# EasyEDA Pro project stm32f401rct6v1.eprj, schematic STM32F401RCT6V1B

## Sheets
1 P1: Create Date: 2024-03-28; Page Name: P1; Project Name: stm32f401rct6v1; Schematic Name: STM32F401RCT6V1B; Update Date: 2024-03-28; Company: 嘉立创EDA; Page Size: A4; Version: V1.0
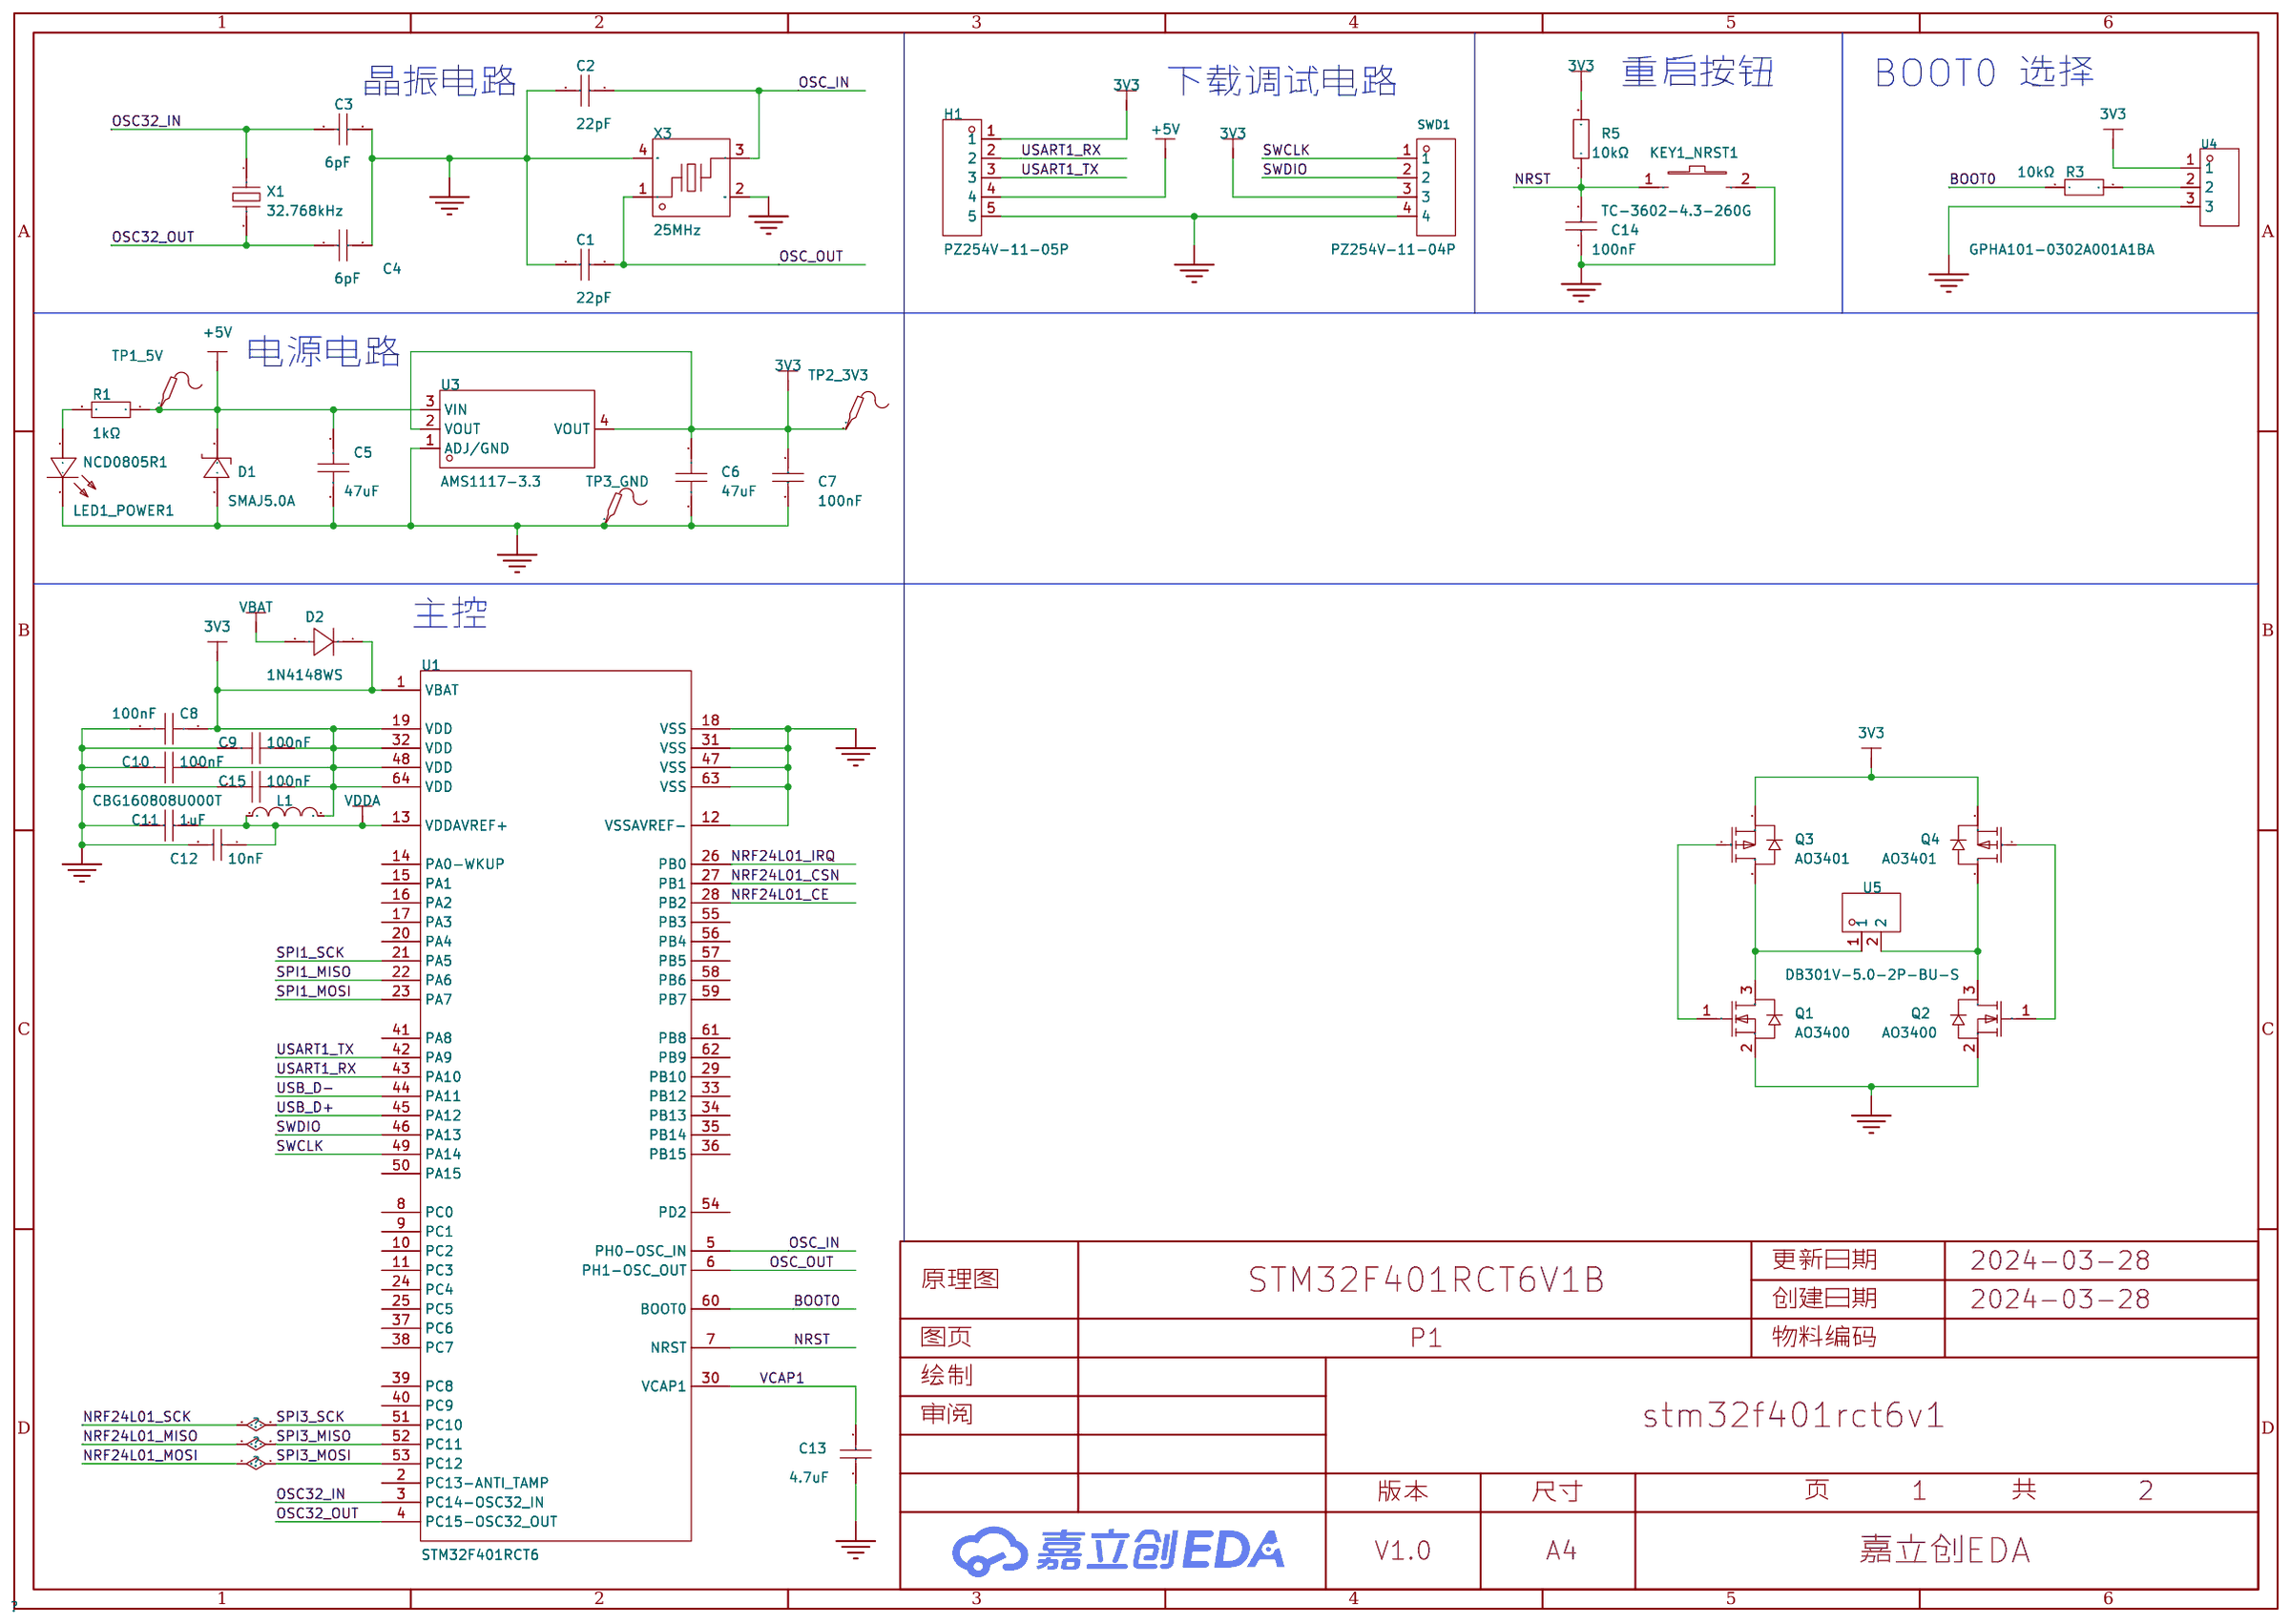
[diagram p1: P1]
2 P2: Page Name: P2
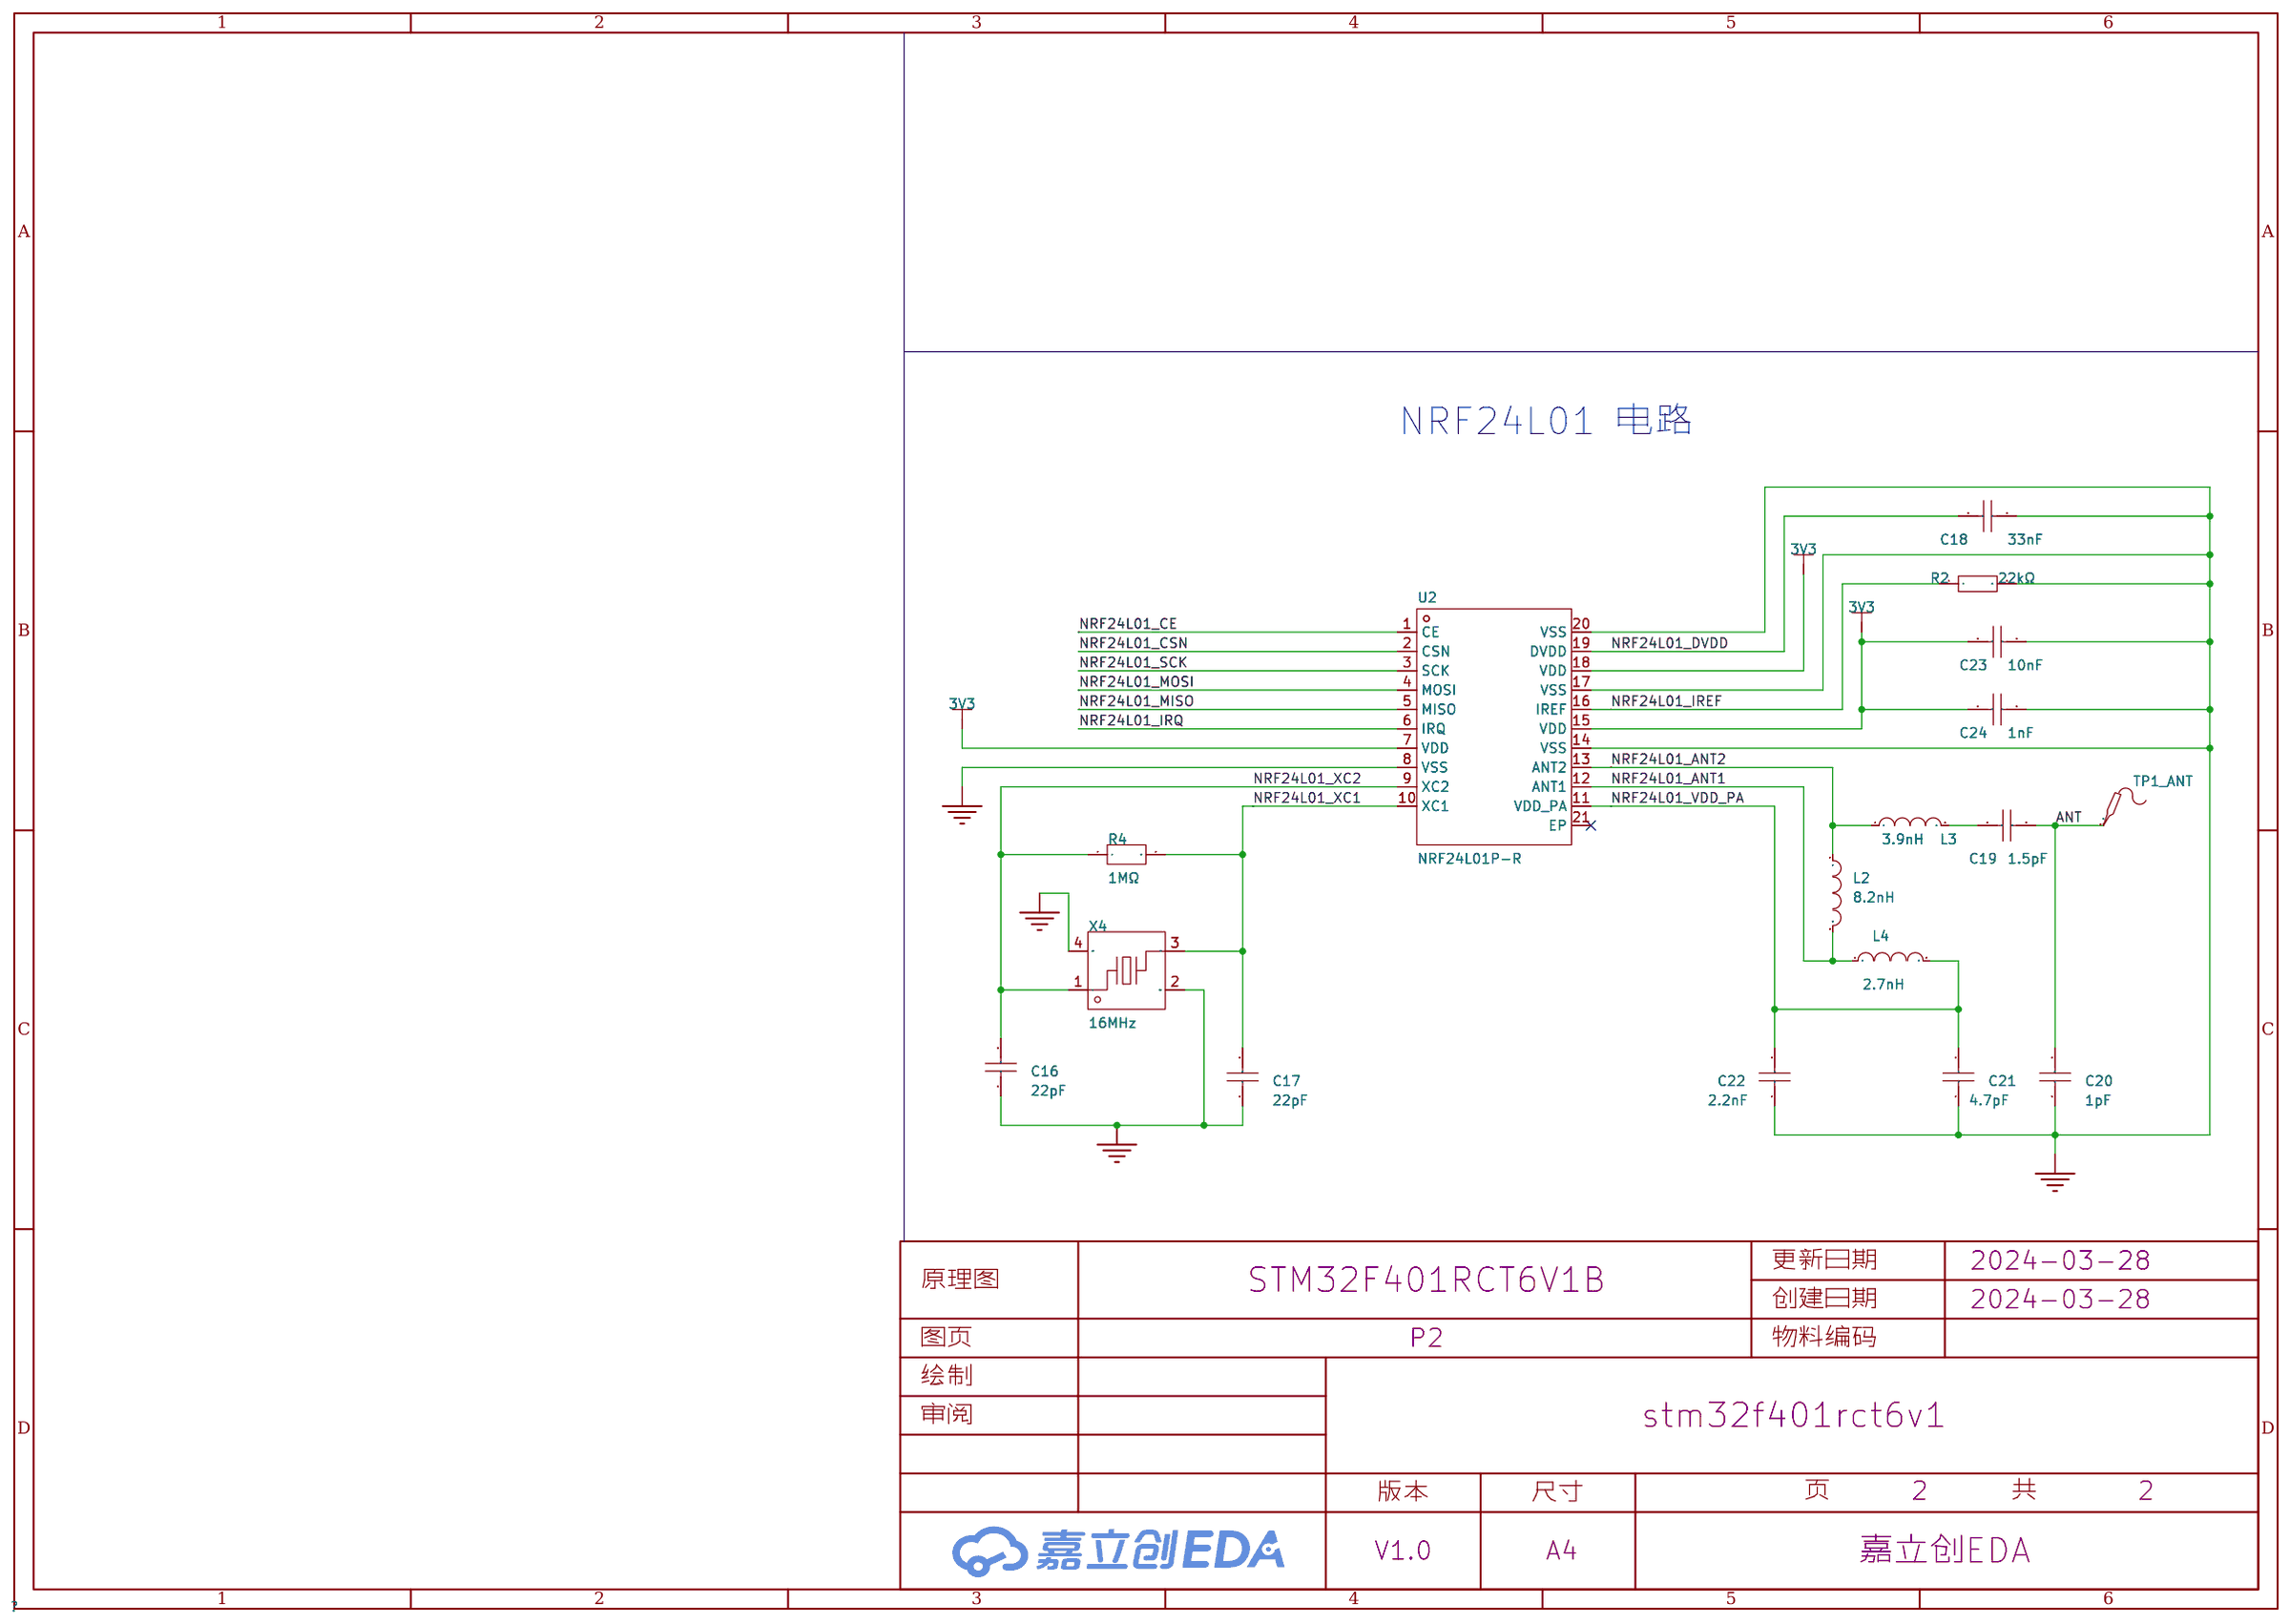
[diagram p2: P2]

## Parts
sheet P1
C1  22pF  [C0603]
C2  22pF  [C0603]
C3  6pF  [C0603]
C4  6pF  [C0603]
C5  47uF  [C1206]
C6  47uF  [C1206]
C7  100nF  [C1206]
C8  100nF  [C0603]
C9  100nF  [C0603]
C10  100nF  [C0603]
C11  1uF  [C0603]
C12  10nF  [C0603]
C13  4.7uF  [C0603]
C14  100nF  [C0603]
C15  100nF  [C0603]
D1  SMAJ5.0A  [SMA_L4.3-W2.6-LS5.2-RD]
D2  1N4148WS  [SOD-323_L1.8-W1.3-LS2.5-RD]
H1  PZ254V-11-05P  [HDR-TH_5P-P2.54-V-M]
KEY1_NRST1  TC-3602-4.3-260G  [KEY-SMD_L6.0-W3.6-LS8.3-L]
L1  CBG160808U000T  [L0603]
LED1_POWER1  NCD0805R1  [LED0805-R-RD]
Q1  AO3400  [SOT-23_L2.9-W1.3-P1.90-LS2.4-BR]
Q2  AO3400  [SOT-23_L2.9-W1.3-P1.90-LS2.4-BR]
Q3  AO3401  [SOT-23-3_L2.9-W1.4-P1.90-LS2.6-BR]
Q4  AO3401  [SOT-23-3_L2.9-W1.4-P1.90-LS2.6-BR]
R1  1kΩ  [R0603]
R3  10kΩ  [R0603]
R5  10kΩ  [R0603]
SWD1  PZ254V-11-04P  [HDR-TH_4P-P2.54-V-M]
TP1_5V  -  [Test-Point-0.5mm]
TP2_3V3  -  [Test-Point-0.5mm]
TP3_GND  -  [Test-Point-0.5mm]
U1  STM32F401RCT6  [LQFP-64_L10.0-W10.0-P0.50-LS12.0-BL]
U3  AMS1117-3.3  [SOT-223_L6.5-W3.5-P2.30-LS7.0-BR]
U4  GPHA101-0302A001A1BA  [HDR-TH_3P-P2.54-V-M]
U5  DB301V-5.0-2P-BU-S  [CONN-TH_2P-P5.00_L7.6-W10.0]
X1  32.768kHz  [OSC-SMD_L3.2-W1.5]
X3  25MHz  [CRYSTAL-SMD_4P-L3.2-W2.5-BL]
sheet P2
C16  22pF  [C0603]
C17  22pF  [C0603]
C18  33nF  [C0603]
C19  1.5pF  [C0603]
C20  1pF  [C0603]
C21  4.7pF  [C0603]
C22  2.2nF  [C0603]
C23  10nF  [C0603]
C24  1nF  [C0603]
L2  8.2nH  [L0603]
L3  3.9nH  [IND-SMD_L1.6-W0.8-1]
L4  2.7nH  [L0603]
R2  22kΩ  [R0603]
R4  1MΩ  [R0603]
TP1_ANT  -  [Test-Point-0.5mm]
U2  NRF24L01P-R  [QFN-20_L4.0-W4.0-P0.50-BL-EP]
X4  16MHz  [CRYSTAL-SMD_4P-L2.0-W1.6-BL]

## Library data of the parts
C1 C2 C16 C17 = CC0603JRNPO9BN220: 容值:22pF;精度:±5%;额定电压:50V;材质(温度系数):NP0;; LCSC Part Name: 22pF ±5% 50V; Supplier Part: C105620; Manufacturer: YAGEO(国巨); Supplier Footprint: 0603; JLCPCB Part Class: 扩展库; Datasheet: https://atta.szlcsc.com/upload/public/pdf/source/20170505/1493957838062.pdf; Supplier: LCSC; Tolerance: ±5%; Voltage Rated: 50V; Temperature Coefficient: NP0
C3 C4 = 0603CG6R0C500NT: 容值:6pF;额定电压:50V;材质(温度系数):C0G;; LCSC Part Name: 6pF 50V ±0.25pF; Supplier Part: C37474; Manufacturer: FH(风华); Supplier Footprint: 0603; JLCPCB Part Class: 扩展库; Datasheet: https://atta.szlcsc.com/upload/public/pdf/source/20200305/C486355_26A10D38EF8C2A5C37091D0039909270.pdf; Supplier: LCSC; Voltage Rated: 50V; Temperature Coefficient: C0G
C5 C6 = GRM31CR61E476ME44L: 容值:47uF;精度:±20%;额定电压:25V;材质(温度系数):X5R;; LCSC Part Name: 47uF ±20% 25V; Supplier Part: C403725; Manufacturer: muRata(村田); Supplier Footprint: 1206; JLCPCB Part Class: 扩展库; Datasheet: https://atta.szlcsc.com/upload/public/pdf/source/20191025/C403725_B8A8CD2FFA1F57E6FDF268BD106459D5.pdf; Supplier: LCSC; Tolerance: ±20%; Voltage Rated: 25V; Temperature Coefficient: X5R
C7 = CL31B104KBCNNNC: 容值:100nF;精度:±10%;额定电压:50V;材质(温度系数):X7R;; LCSC Part Name: 100nF ±10% 50V; Supplier Part: C24497; Manufacturer: SAMSUNG(三星); Supplier Footprint: 1206; JLCPCB Part Class: 基础库; Datasheet: https://atta.szlcsc.com/upload/public/pdf/source/20160218/1457707763339.pdf; Supplier: LCSC; Tolerance: ±10%; Voltage Rated: 50V; Temperature Coefficient: X7R
C8-C10 C15 = CC0603KRX7R9BB104: 容值:100nF;精度:±10%;额定电压:50V;材质(温度系数):X7R;; LCSC Part Name: 100nF ±10% 50V; Supplier Part: C14663; Manufacturer: YAGEO(国巨); Supplier Footprint: 0603; JLCPCB Part Class: 基础库; Datasheet: https://atta.szlcsc.com/upload/public/pdf/source/20180910/C282072_33301C7F631E79921B82A8DAC6BCC5B3.pdf; Supplier: LCSC; Tolerance: ±10%; Voltage Rated: 50V; Temperature Coefficient: X7R
C11 = CL10A105KB8NNNC: 容值:1uF;精度:±10%;额定电压:50V;材质(温度系数):X5R;; LCSC Part Name: 1uF ±10% 50V; Supplier Part: C15849; Manufacturer: SAMSUNG(三星); Supplier Footprint: 0603; JLCPCB Part Class: 基础库; Datasheet: https://atta.szlcsc.com/upload/public/pdf/source/20160218/1457707763339.pdf; Supplier: LCSC; Tolerance: ±10%; Voltage Rated: 50V; Temperature Coefficient: X5R
C12 C23 = CC0603KRX7R9BB103: 容值:10nF;精度:±10%;额定电压:50V;材质(温度系数):X7R;; LCSC Part Name: 10nF ±10% 50V; Supplier Part: C100042; Manufacturer: YAGEO(国巨); Supplier Footprint: 0603; JLCPCB Part Class: 扩展库; Datasheet: https://atta.szlcsc.com/upload/public/pdf/source/20181008/C309510_22F155564471FAF6A489F7D68F34234E.pdf; Supplier: LCSC; Tolerance: ±10%; Voltage Rated: 50V; Temperature Coefficient: X7R
C13 = CL10A475KO8NNNC: 容值:4.7uF;精度:±10%;额定电压:16V;材质(温度系数):X5R;; LCSC Part Name: 4.7uF ±10% 16V; Supplier Part: C19666; Manufacturer: SAMSUNG(三星); Supplier Footprint: 0603; JLCPCB Part Class: 基础库; Datasheet: https://atta.szlcsc.com/upload/public/pdf/source/20160218/1457707763339.pdf; Supplier: LCSC; Tolerance: ±10%; Voltage Rated: 16V; Temperature Coefficient: X5R
C14 = 0603B104K500NT: 容值:100nF;精度:±10%;额定电压:50V;材质(温度系数):X7R;; LCSC Part Name: 100nF ±10% 50V; Supplier Part: C30926; Manufacturer: FH(风华); Supplier Footprint: 0603; JLCPCB Part Class: 扩展库; Datasheet: https://atta.szlcsc.com/upload/public/pdf/source/20200305/C486355_26A10D38EF8C2A5C37091D0039909270.pdf; Supplier: LCSC; Tolerance: ±10%; Voltage Rated: 50V; Temperature Coefficient: X7R
D1 = SMAJ5.0A_C10758: 反向截止电压(Vrwm):5V;最大钳位电压:9.2V;峰值脉冲电流(Ipp)@10/1000us:43.5A;击穿电压:6.4V;; LCSC Part Name: 单向TVS 5V截止 43.5A峰值脉冲; Supplier Part: C10758; Manufacturer: RUILON(瑞隆源); Supplier Footprint: SMA(DO-214AC); JLCPCB Part Class: 扩展库; Datasheet: https://atta.szlcsc.com/upload/public/pdf/source/20180711/C81281_95CC36DD15828E233F5FA92369DBC9C5.pdf; Supplier: LCSC; Reverse Stand-Off Voltage (Vrwm): 5V; Maximum Clamping Voltage: 9.2V; Peak Pulse Current (Ipp)@10/1000us: 43.5A; Breakdown Voltage: 6.4V; Type: TVS
D2 = 1N4148WS_C917117: 二极管配置:独立式;正向压降(Vf):1.25V@150mA;直流反向耐压(Vr):100V;平均整流电流(Io):300mA;功率:400mW;反向恢复时间(trr):8ns;; LCSC Part Name: 电压:100V 电流:300mA; Supplier Part: C917117; Manufacturer: JSMSEMI(杰盛微); Supplier Footprint: SOD-323; JLCPCB Part Class: 扩展库; Datasheet: https://atta.szlcsc.com/upload/public/pdf/source/20230807/08D9F448A82EA88A23B325A669586A09.pdf; Supplier: LCSC; Diode Configuration: 独立式; Forward Voltage (Vf@If): 1.25V@150mA; Reverse Voltage (Vr): 100V; Average Rectified Current (Io): 300mA; Power Dissipation: 400mW; Reverse Leakage Current: 1uA@75V; Reverse Recovery Time (trr): 8ns; Operating Temperature: -55℃~+150℃@(Tj)
H1 = PZ254V-11-05P: 插针结构:1x5P;间距:2.54mm;行距:-;圆针/方针:方针;安装类型:直插;排数:单排;总PIN位数:5P;额定电流:-;额定电压:-;配合针长度:6mm;塑高:2.5mm;端接针长度:3mm;触头材质:黄铜;触头镀层:-;工作温度范围:-40℃~+105℃;颜色:黑色;; LCSC Part Name: 间距:2.54mm 1x5P 直插 方针; Supplier Part: C492404; Manufacturer: XFCN(兴飞); Supplier Footprint: 插件,P=2.54mm; JLCPCB Part Class: 扩展库; Datasheet: https://atta.szlcsc.com/upload/public/pdf/source/20200309/C492404_E51533260F8710EFF5D4617281164C1D.pdf; Supplier: LCSC; Pin Structure: 1x5P; Pitch: 2.54mm; Circluar Pins/Square Pins: 方针; Mounting Type: 直插; Number of Rows: 单排; Number of Pins: 5P; Length of Mating Pin: 6mm; Insulation Height: 2.5mm; Length of End Connection Pin: 3mm; Contact Material: 黄铜; Operating Temperature Range: -40℃~+105℃; Color: 黑色
KEY1_NRST1 = TC-3602-4.3-260G_C3012022: 电路结构:单刀单掷;带支架:否;触点电流:50mA;额定电压(AC):-;额定电压(DC):12V;额定功率:-;安装方式:立贴;绝缘电阻:-;带灯:无;作用力:260gf;机械寿命:10万次;; LCSC Part Name: 3*6*4.3mm 立贴 轻触开关; Supplier Part: C3012022; Manufacturer: HCTL(华灿天禄); Supplier Footprint: SMD; JLCPCB Part Class: 扩展库; Datasheet: https://atta.szlcsc.com/upload/public/pdf/source/20210730/C2845293_5277CDF8C59032B794BE536E6FDEACDD.pdf; Supplier: LCSC; Circuit: 单刀单掷; Actuator Style: 圆形按钮; Switch Length: 3mm; Switch Width: 6mm; Switch Height: 4.3mm; Strike Gundam: 否; Contact Current: 50mA; Voltage Rating (DC): 12V; Mounting Style: 立贴; Actuator/Cap Color: 白色; With Lamp: 无; Operating Force: 260gf; Mechanical Life: 10万次; Operating Temperature: -30℃~+85℃
L1 = CBG160808U000T: 标称阻抗@测试频率:0Ω@100MHz;直流电阻(RDC):100mΩ;; LCSC Part Name: 单路 0603磁珠 阻抗0Ω@100MHz; Supplier Part: C43163; Manufacturer: FH(风华); Supplier Footprint: 0603; JLCPCB Part Class: 扩展库; Datasheet: https://atta.szlcsc.com/upload/public/pdf/source/20190129/C361667_1614D407CC98D1D3CFBD9E1F7511C14D.pdf; Supplier: LCSC; Impedance @ Frequency: 0Ω@100MHz; DC Resistance: 100mΩ; Current Rating: 800mA; Circuits: 1
LED1_POWER1 = NCD0805R1: 灯头类型:-;发光颜色:红色;正向电压(VF):1.6V~2.6V;功率:65mW;正向电流:20mA;主波长:615nm~630nm;二极管配置:独立二极管;透镜颜色:无色透明;色温:-;发光强度:67mcd~195mcd;发光角度:130°;载带方式:-;工作温度:-30℃~+85℃;; Supplier Part: C84256; Manufacturer: 国星光电; Supplier Footprint: 0805; JLCPCB Part Class: 基础库; Datasheet: https://atta.szlcsc.com/upload/public/pdf/source/20200820/C84256_F0A75A43B3EAD75808600A0514C76B99.pdf; Supplier: LCSC; Emitted Color: 红色; Forward Voltage (VF): 1.6V~2.6V; Power Dissipation: 65mW; Forward Current: 20mA; Dominant Wavelength: 615nm~630nm; Diode Configuration: 独立二极管; Lens Color: 无色透明; Luminous Intensity: 67mcd~195mcd; Viewing Angle: 130°; Operating Temperature: -30℃~+85℃
Q1 Q2 = AO3400_C2938367: 类型:N沟道;漏源电压(Vdss):30V;连续漏极电流(Id):5.8A;功率(Pd):1.5W;导通电阻(RDS(on)@Vgs,Id):35mΩ@10V,5.8A;阈值电压(Vgs(th)@Id):1.2V@250uA;; LCSC Part Name: N沟道 耐压:30V 电流:5.8A; Supplier Part: C2938367; Manufacturer: GOODWORK(固得沃克); Supplier Footprint: SOT-23; JLCPCB Part Class: 扩展库; Datasheet: https://atta.szlcsc.com/upload/public/pdf/source/20211229/1DE691E24B5B31BB262C463D0489A9AB.pdf; Supplier: LCSC; Type: N沟道; Drain Source Voltage (Vdss): 30V; Continuous Drain Current (Id): 5.8A; Power Dissipation (Pd): 1.5W; Drain Source On Resistance (RDS(on)@Vgs,Id): 35mΩ@10V,5.8A; Gate Threshold Voltage (Vgs(th)@Id): 1.2V@250uA; Input Capacitance (Ciss@Vds): 1.05nF@15V; Reverse Transfer Capacitance (Crss@Vds): 77pF@15V
Q3 Q4 = AO3401_C727156: 类型:P沟道;漏源电压(Vdss):30V;连续漏极电流(Id):4.2A;功率(Pd):350mW;导通电阻(RDS(on)@Vgs,Id):65mΩ@10V,4.2A;阈值电压(Vgs(th)@Id):1.3V@250uA;; LCSC Part Name: P沟道 耐压:30V 电流:4.2A; Supplier Part: C727156; Manufacturer: TWGMC(台湾迪嘉); Supplier Footprint: SOT-23; JLCPCB Part Class: 扩展库; Datasheet: https://atta.szlcsc.com/upload/public/pdf/source/20200827/C727156_6E081BBEEFBC6B8FEE164CB196B0AF30.pdf; Supplier: LCSC; Type: P沟道; Drain Source Voltage (Vdss): 30V; Continuous Drain Current (Id): 4.2A; Power Dissipation (Pd): 350mW; Drain Source On Resistance (RDS(on)@Vgs,Id): 65mΩ@10V,4.2A; Gate Threshold Voltage (Vgs(th)@Id): 1.3V@250uA
R1 = RC0603FR-071KL: 电阻类型:厚膜电阻;阻值:1kΩ;精度:±1%;功率:100mW;; LCSC Part Name: 1kΩ ±1% 100mW; Supplier Part: C22548; Manufacturer: YAGEO(国巨); Supplier Footprint: 0603; JLCPCB Part Class: 扩展库; Datasheet: https://atta.szlcsc.com/upload/public/pdf/source/20180312/7BD3618A8B6324EA6280B0497A051AB7.pdf; Supplier: LCSC; Type: 厚膜电阻; Tolerance: ±1%; Power(Watts): 100mW; Temperature Coefficient: ±100ppm/℃; Overload Voltage (Max): 75V; Operating Temperature Range: -55℃~+155℃
R3 R5 = 0603WAF1002T5E: 电阻类型:厚膜电阻;阻值:10kΩ;精度:±1%;功率:100mW;最大工作电压:75V;温度系数:±100ppm/℃;; LCSC Part Name: 10kΩ ±1% 100mW 厚膜电阻; Supplier Part: C25804; Manufacturer: UNI-ROYAL(厚声); Supplier Footprint: 0603; JLCPCB Part Class: 基础库; Datasheet: https://atta.szlcsc.com/upload/public/pdf/source/20200306/C422600_1E6D84923E4A46A82E41ADD87F860B5C.pdf; Supplier: LCSC; Type: 厚膜电阻; Tolerance: ±1%; Power(Watts): 100mW; Overload Voltage (Max): 75V; Temperature Coefficient: ±100ppm/℃; Operating Temperature Range: -55℃~+155℃
SWD1 = PZ254V-11-04P: 排数:单排;总PIN位数:4P;间距:2.54mm;插针结构:1x4P;行距:-;安装类型:直插;圆针/方针:方针;额定电流:3A;额定电压:250V;配合针长度:6mm;塑高:2.5mm;端接针长度:3mm;触头材质:-;工作温度范围:-40℃~+105℃;颜色:黑色;; LCSC Part Name: 2.54mm 1x4P 直插 方针; Supplier Part: C2691448; Manufacturer: XFCN(兴飞); Supplier Footprint: 插件,P=2.54mm; JLCPCB Part Class: 扩展库; Datasheet: https://atta.szlcsc.com/upload/public/pdf/source/20200309/C492403_F9F19131791D08044AD4F84F8E751A34.pdf; Supplier: LCSC; Number of Rows: 单排; Number of Pins: 4P; Pitch: 2.54mm; Pin Structure: 1x4P; Mounting Type: 直插; Circluar Pins/Square Pins: 方针; Current Rating (Max): 3A; Voltage Rating (Max): 250V; Length of Mating Pin: 6mm; Insulation Height: 2.5mm; Length of End Connection Pin: 3mm; Operating Temperature Range: -40℃~+105℃; Color: 黑色
TP1_5V TP1_ANT TP2_3V3 TP3_GND = Test-Point: Test Point 测试点
U1 = STM32F401RCT6: CPU内核:ARM Cortex-M4;CPU最大主频:84MHz;工作电压范围:1.7V~3.6V;程序存储容量:256KB;程序存储器类型:FLASH;RAM总容量:64KB;GPIO端口数量:50;; Supplier Part: C74524; Manufacturer: ST(意法半导体); Supplier Footprint: LQFP-64(10x10); JLCPCB Part Class: 扩展库; Datasheet: https://atta.szlcsc.com/upload/public/pdf/source/20170712/C118825_1499827770838813456.pdf; Supplier: LCSC; CPU Core: ARM Cortex-M4; CPU Maximum Speed: 84MHz; Operating Voltage Range: 1.7V~3.6V; Program Storage Size: 256KB; Program Memory Type: FLASH; RAM Size: 64KB; GPIO Ports Number: 50; ADC (Bit): 12bit; Universal Serial Bus: 有; Peripheral/Function: PWM；PWM; Watchdog: 有; Infrared Data Association: 有; Low-Voltage Detect: 有; Secure Digital Input and Output: 有; Direct Memory Access: 有; Internal Oscillator: 有; Operating Temperature Range: -40℃~+85℃
U3 = AMS1117-3.3_C426566: 输出类型:固定;最大输入电压:18V;输出电压:3.3V;输出电流:1A;电源纹波抑制比(PSRR):70dB@(120Hz);输出极性:正;; LCSC Part Name: 输入18V 输出3.3V 1A; Supplier Part: C426566; Manufacturer: Slkor(萨科微); Supplier Footprint: SOT-223; JLCPCB Part Class: 扩展库; Datasheet: https://atta.szlcsc.com/upload/public/pdf/source/20201231/C426566_7F22DB93439D00F3FA27143E4F28C6AA.pdf; Supplier: LCSC; Output Type: 固定; Maximum Input Voltage: 18V; Output Voltage: 3.3V; Output Current: 1A; Power Supply Rejection Ratio (PSRR): 70dB@(120Hz); Dropout Voltage: 1.4V@(1A); Output Polarity: 正; Number of Outputs: 1
U4 = GPHA101-0302A001A1BA: 插针结构:1x3P;间距:2.54mm;行距:2.54mm;圆针/方针:方针;安装类型:直插;排数:单排;总PIN位数:3P;额定电流:3A;工作温度范围:-40℃~+105℃;; LCSC Part Name: 1x3P 间距:2.54mm 方针 直插; Supplier Part: C7434480; Manufacturer: GREENCONN(格康); Supplier Footprint: 插件,P=2.54mm; Datasheet: https://atta.szlcsc.com/upload/public/pdf/source/20230629/29B861B43DC477A011ED023B9618EA31.pdf; Supplier: LCSC; Pin Structure: 1x3P; Pitch: 2.54mm; Row Spacing: 2.54mm; Circluar Pins/Square Pins: 方针; Mounting Type: 直插; Number of Rows: 单排; Number of Pins: 3P; Current Rating (Max): 3A; Operating Temperature Range: -40℃~+105℃
U5 = DB301V-5.0-2P-BU-S: 结构:1x2P;间距:5mm;颜色:蓝色;安装方式:直插;额定电流:17.5A;额定电压:250V;排数:1;线规 - AWG:14~22;线规 - 平方毫米:1.5;每排PIN数:2;工作温度范围:-40℃~+120℃;; LCSC Part Name: 5mm 1x2P 排数:1 每排P数:2 直插; Supplier Part: C395882; Manufacturer: DORABO(地博电气); Supplier Footprint: 插件,P=5mm; JLCPCB Part Class: 扩展库; Datasheet: https://atta.szlcsc.com/upload/public/pdf/source/20230321/D511151DA9A574FE7610C3CBEF6C1AC3.pdf; Supplier: LCSC; Structure: 1x2P; Pitch: 5mm; Color: 蓝色; Mounting Style: 直插; Current Rating (Max): 17.5A; Voltage Rating (Max): 250V; Number of Pins: 2P; Number of Rows: 1; Wire Gauge - AWG: 14~22; Wire Gauge - mm2: 1.5; Number of PINs Per Row: 2; Operating Temperature Range: -40℃~+120℃
X1 = X321532768KGD2SI: 频率:32.768kHz;负载电容:12.5pF;频率公差:±20ppm;; LCSC Part Name: 32.768kHz ±20ppm 12.5pF YST310S; Supplier Part: C620155; Manufacturer: YXC(扬兴晶振); Supplier Footprint: SMD3215-2P; JLCPCB Part Class: 扩展库; Datasheet: https://atta.szlcsc.com/upload/public/pdf/source/20210329/C620155_E5A74FC0D27C5E9015A8D75DE9484FEA.pdf; Supplier: LCSC; Crystal Type: 贴片无源晶振; Load Capacitance: 12.5pF; Frequency Tolerance: ±20ppm; Operating Temperature: -40℃~+85℃
X3 = XL2EL89CSI-111YLC-25M: 频率:25MHz;负载电容:20pF;频率公差:±10ppm;; LCSC Part Name: 25MHz ±10ppm 20pF YSX321SL; Supplier Part: C5280577; Manufacturer: YXC(扬兴晶振); Supplier Footprint: SMD3225-4P; JLCPCB Part Class: 扩展库; Datasheet: https://atta.szlcsc.com/upload/public/pdf/source/20221123/8DAA01809C4E3F159850A71277C18D74.pdf; Supplier: LCSC; Crystal Type: 贴片无源晶振; Load Capacitance: 20pF; Frequency Tolerance: ±10ppm
C18 = CL10B333KB8NNNC: 容值:33nF;精度:±10%;额定电压:50V;材质(温度系数):X7R;; LCSC Part Name: 33nF ±10% 50V; Supplier Part: C21117; Manufacturer: SAMSUNG(三星); Supplier Footprint: 0603; JLCPCB Part Class: 基础库; Datasheet: https://atta.szlcsc.com/upload/public/pdf/source/20160218/1457707763339.pdf; Supplier: LCSC; Tolerance: ±10%; Voltage Rated: 50V; Temperature Coefficient: X7R
C19 = 0603CG1R5C500NT: 容值:1.5pF;额定电压:50V;材质(温度系数):C0G;; LCSC Part Name: 1.5pF 50V; Supplier Part: C1639; Manufacturer: FH(风华); Supplier Footprint: 0603; JLCPCB Part Class: 扩展库; Datasheet: https://atta.szlcsc.com/upload/public/pdf/source/20200305/C486355_26A10D38EF8C2A5C37091D0039909270.pdf; Supplier: LCSC; Voltage Rated: 50V; Temperature Coefficient: C0G
C20 = 0603CG1R0C500NT: 容值:1pF;额定电压:50V;材质(温度系数):C0G;; LCSC Part Name: 1pF 50V; Supplier Part: C37117; Manufacturer: FH(风华); Supplier Footprint: 0603; JLCPCB Part Class: 扩展库; Datasheet: https://atta.szlcsc.com/upload/public/pdf/source/20200305/C486355_26A10D38EF8C2A5C37091D0039909270.pdf; Supplier: LCSC; Voltage Rated: 50V; Temperature Coefficient: C0G
C21 = 0603CG4R7C500NT: 容值:4.7pF;额定电压:50V;材质(温度系数):C0G;; LCSC Part Name: 4.7pF 50V; Supplier Part: C1669; Manufacturer: FH(风华); Supplier Footprint: 0603; JLCPCB Part Class: 扩展库; Datasheet: https://atta.szlcsc.com/upload/public/pdf/source/20200305/C486355_26A10D38EF8C2A5C37091D0039909270.pdf; Supplier: LCSC; Voltage Rated: 50V; Temperature Coefficient: C0G
C22 = 0603B222K500NT: 容值:2.2nF;精度:±10%;额定电压:50V;材质(温度系数):X7R;; LCSC Part Name: 2.2nF ±10% 50V; Supplier Part: C1604; Manufacturer: FH(风华); Supplier Footprint: 0603; JLCPCB Part Class: 基础库; Datasheet: https://atta.szlcsc.com/upload/public/pdf/source/20200305/C486355_26A10D38EF8C2A5C37091D0039909270.pdf; Supplier: LCSC; Tolerance: ±10%; Voltage Rated: 50V; Temperature Coefficient: X7R
C24 = CC0603KRX7R9BB102: 容值:1nF;精度:±10%;额定电压:50V;材质(温度系数):X7R;; LCSC Part Name: 1nF ±10% 50V; Supplier Part: C100040; Manufacturer: YAGEO(国巨); Supplier Footprint: 0603; JLCPCB Part Class: 扩展库; Datasheet: https://atta.szlcsc.com/upload/public/pdf/source/20180910/C282072_33301C7F631E79921B82A8DAC6BCC5B3.pdf; Supplier: LCSC; Tolerance: ±10%; Voltage Rated: 50V; Temperature Coefficient: X7R
L2 = VHF160808H8N2JT: 电感值:8.2nH;精度:±5%;额定电流:400mA;饱和电流(Isat):-;直流电阻(DCR):350mΩ;; LCSC Part Name: 8.2nH ±5%; Supplier Part: C90204; Manufacturer: FH(风华); Supplier Footprint: 0603; JLCPCB Part Class: 扩展库; Datasheet: https://atta.szlcsc.com/upload/public/pdf/source/20230223/8EF545BE87E825DABED9AF3380ABCE94.pdf; Supplier: LCSC; Tolerance: ±5%; Rated Current: 400mA; DC Resistance (DCR): 350mΩ
L3 = LQW18AN3N9C10D: 电感值:3.9nH;额定电流:1A;饱和电流(Isat):-;; Supplier Part: C521237; Manufacturer: muRata(村田); Supplier Footprint: 0603; JLCPCB Part Class: 扩展库; Datasheet: https://atta.szlcsc.com/upload/public/pdf/source/20181211/C341790_D709A266A9D251194E0E402A9D974B33.pdf; Supplier: LCSC; Rated Current: 1A; DC Resistance (DCR): 32mΩ
L4 = SCC1608C2N7SSP: 电感值:2.7nH;额定电流:500mA;饱和电流(Isat):-;直流电阻(DCR):200mΩ;; Supplier Part: C412027; Manufacturer: Sunltech(韩国顺磁); Supplier Footprint: 0603; JLCPCB Part Class: 扩展库; Datasheet: https://atta.szlcsc.com/upload/public/pdf/source/20190819/C412052_7E47CA9107AD18C13168C896A90007C8.pdf; Supplier: LCSC; Rated Current: 500mA; DC Resistance (DCR): 200mΩ
R2 = 0603WAF2202T5E: 电阻类型:厚膜电阻;阻值:22kΩ;精度:±1%;功率:100mW;最大工作电压:75V;温度系数:±100ppm/℃;; LCSC Part Name: 22kΩ ±1% 100mW 厚膜电阻; Supplier Part: C31850; Manufacturer: UNI-ROYAL(厚声); Supplier Footprint: 0603; JLCPCB Part Class: 基础库; Datasheet: https://atta.szlcsc.com/upload/public/pdf/source/20200306/C422600_1E6D84923E4A46A82E41ADD87F860B5C.pdf; Supplier: LCSC; Type: 厚膜电阻; Tolerance: ±1%; Power(Watts): 100mW; Overload Voltage (Max): 75V; Temperature Coefficient: ±100ppm/℃; Operating Temperature Range: -55℃~+155℃
R4 = SC0603F1004F2BNRH: 阻值:1MΩ;精度:±1%;功率:-;温度系数:±100ppm/℃;; LCSC Part Name: 1MΩ ±1%; Supplier Part: C3152128; Manufacturer: Sunway(信维通信); Supplier Footprint: 0603; JLCPCB Part Class: 扩展库; Datasheet: https://atta.szlcsc.com/upload/public/pdf/source/20220728/FFCE43BB6DF8FA16AEE331F0F4B289DE.pdf; Supplier: LCSC; Tolerance: ±1%; Temperature Coefficient: ±100ppm/℃
U2 = NRF24L01P-R: 频率范围:2.4GHz;接口:SPI;应用领域:通用 ISM>1GHz;数据速率:2Mbps;灵敏度:-94dBm;典型应用频率:2.4GHz;; LCSC Part Name: 单芯片2.4GHz收发器; Supplier Part: C8791; Manufacturer: NORDIC; Supplier Footprint: QFN-20-EP(4x4); JLCPCB Part Class: 扩展库; Datasheet: https://atta.szlcsc.com/upload/public/pdf/source/20120816/1457706530106.pdf; Supplier: LCSC; Frequency Range: 2.4GHz; Interface: SPI; Operating Voltage: 1.9V~3.6V; Applications: 通用 ISM>1GHz; Output Power: 0dBm; Data Rate: 2Mbps; Current Of Transmitting: 7mA; Sensitivity: -94dBm; Receive Current: 12.6mA; Typical Application Frequency: 2.4GHz; Operating Temperature: -40℃~+85℃
X4 = XL7EL89COI-111YLC-16M: 晶振类型:贴片晶振;频率:16MHz;常温频差:±10ppm;外接负载电容:12pF;频率稳定度(全温):±20ppm;; LCSC Part Name: 16MHz ±10ppm 12pF; Supplier Part: C2965579; Manufacturer: YXC(扬兴晶振); Supplier Footprint: SMD2016-4P; JLCPCB Part Class: 扩展库; Datasheet: https://atta.szlcsc.com/upload/public/pdf/source/20220121/6B4B3E7EF7974858943D806BF8CACEA3.pdf; Supplier: LCSC; Crystal Type: 贴片晶振; Normal temperature Frequency Tolerance: ±10ppm; External load capacitor: 12pF; Frequency Stability(Full temperature range): ±20ppm; Operating Temperature: -40℃~+85℃

## Nets
3V3: C6.1 C7.1 C8.1 C9.1 C10.2 C15.1 C23.1 C24.1 D2.1(C) H1.1 L1.2 Q3.2(S) Q4.2(S) R5.2 SWD1.3 TP2_3V3.1 U1.1(VBAT) U1.19(VDD) U1.32(VDD) U1.48(VDD) U1.64(VDD) U2.7(VDD) U2.15(VDD) U2.18(VDD) U3.2(VOUT) U3.4(VOUT) U4.1
+5V: C5.1 D1.1(K) H1.4 R1.1 TP1_5V.1 U3.3(VIN)
GND: C1.1 C2.1 C3.2 C4.2 C5.2 C6.2 C7.2 C8.2 C9.2 C10.1 C11.2 C12.2 C13.2 C14.1 C15.2 C16.2 C17.2 C18.2 C20.2 C21.2 C22.2 C23.2 C24.2 D1.2(A) H1.5 KEY1_NRST1.2 LED1_POWER1.2(-) Q1.2(S) Q2.2(S) R2.2 SWD1.4 TP3_GND.1 U1.12(VSSAVREF-) U1.18(VSS) U1.31(VSS) U1.47(VSS) U1.63(VSS) U2.8(VSS) U2.14(VSS) U2.17(VSS) U2.20(VSS) U3.1(ADJ/GND) U4.3 X3.2(GND) X3.4(GND) X4.2(GND) X4.4(GND)
VBAT: D2.2(A)
VDDA: C11.1 C12.1 L1.1 U1.13(VDDAVREF+)
ANT: C19.2 C20.1 TP1_ANT.1
BOOT0: R3.1 U1.60(BOOT0)
NRF24L01_ANT1: L2.2 L4.1 U2.12(ANT1)
NRF24L01_ANT2: L2.1 L3.1 U2.13(ANT2)
NRF24L01_CE: U1.28(PB2) U2.1(CE)
NRF24L01_CSN: U1.27(PB1) U2.2(CSN)
NRF24L01_DVDD: C18.1 U2.19(DVDD)
NRF24L01_IREF: R2.1 U2.16(IREF)
NRF24L01_IRQ: U1.26(PB0) U2.6(IRQ)
NRF24L01_MISO: U1.52(PC11) U2.5(MISO)
NRF24L01_MOSI: U1.53(PC12) U2.4(MOSI)
NRF24L01_SCK: U1.51(PC10) U2.3(SCK)
NRF24L01_VDD_PA: C21.1 C22.1 L4.2 U2.11(VDD_PA)
NRF24L01_XC1: C17.1 R4.2 U2.10(XC1) X4.3
NRF24L01_XC2: C16.1 R4.1 U2.9(XC2) X4.1
NRST: C14.2 KEY1_NRST1.1 R5.1 U1.7(NRST)
OSC32_IN: C3.1 U1.3(PC14-OSC32_IN) X1.1
OSC32_OUT: C4.1 U1.4(PC15-OSC32_OUT) X1.2
OSC_IN: C2.2 U1.5(PH0-OSC_IN) X3.3
OSC_OUT: C1.2 U1.6(PH1-OSC_OUT) X3.1
SPI1_MISO: U1.22(PA6)
SPI1_MOSI: U1.23(PA7)
SPI1_SCK: U1.21(PA5)
SWCLK: SWD1.1 U1.49(PA14)
SWDIO: SWD1.2 U1.46(PA13)
USART1_RX: H1.2 U1.43(PA10)
USART1_TX: H1.3 U1.42(PA9)
USB_D+: U1.45(PA12)
USB_D-: U1.44(PA11)
VCAP1: C13.1 U1.30(VCAP1)
$1N1755: LED1_POWER1.1(+) R1.2
$1N2983: R3.2 U4.2
$1N4193: Q1.3(D) Q3.3(D) U5.1
$1N4258: Q2.3(D) Q4.3(D) U5.2
$1N4276: Q1.1(G) Q3.1(G)
$1N4281: Q2.1(G) Q4.1(G)
$2N1086: C19.1 L3.2

Not connected (* = marked no-connect by the designer): U1 2(PC13-ANTI_TAMP) 8(PC0) 9(PC1) 10(PC2) 11(PC3) 14(PA0-WKUP) 15(PA1) 16(PA2) 17(PA3) 20(PA4) 24(PC4) 25(PC5) 29(PB10) 33(PB12) 34(PB13) 35(PB14) 36(PB15) 37(PC6) 38(PC7) 39(PC8) 40(PC9) 41(PA8) 50(PA15) 54(PD2) 55(PB3) 56(PB4) 57(PB5) 58(PB6) 59(PB7) 61(PB8) 62(PB9); U2 21(EP)*

## Notes on the sheets
sheet 1
- 重启按钮
- BOOT0 选择
- 晶振电路
- 下载调试电路
- 电源电路
- 主控
sheet 2
- NRF24L01 电路
